# EAGLE design megamidi (EAGLE 7.3.0)
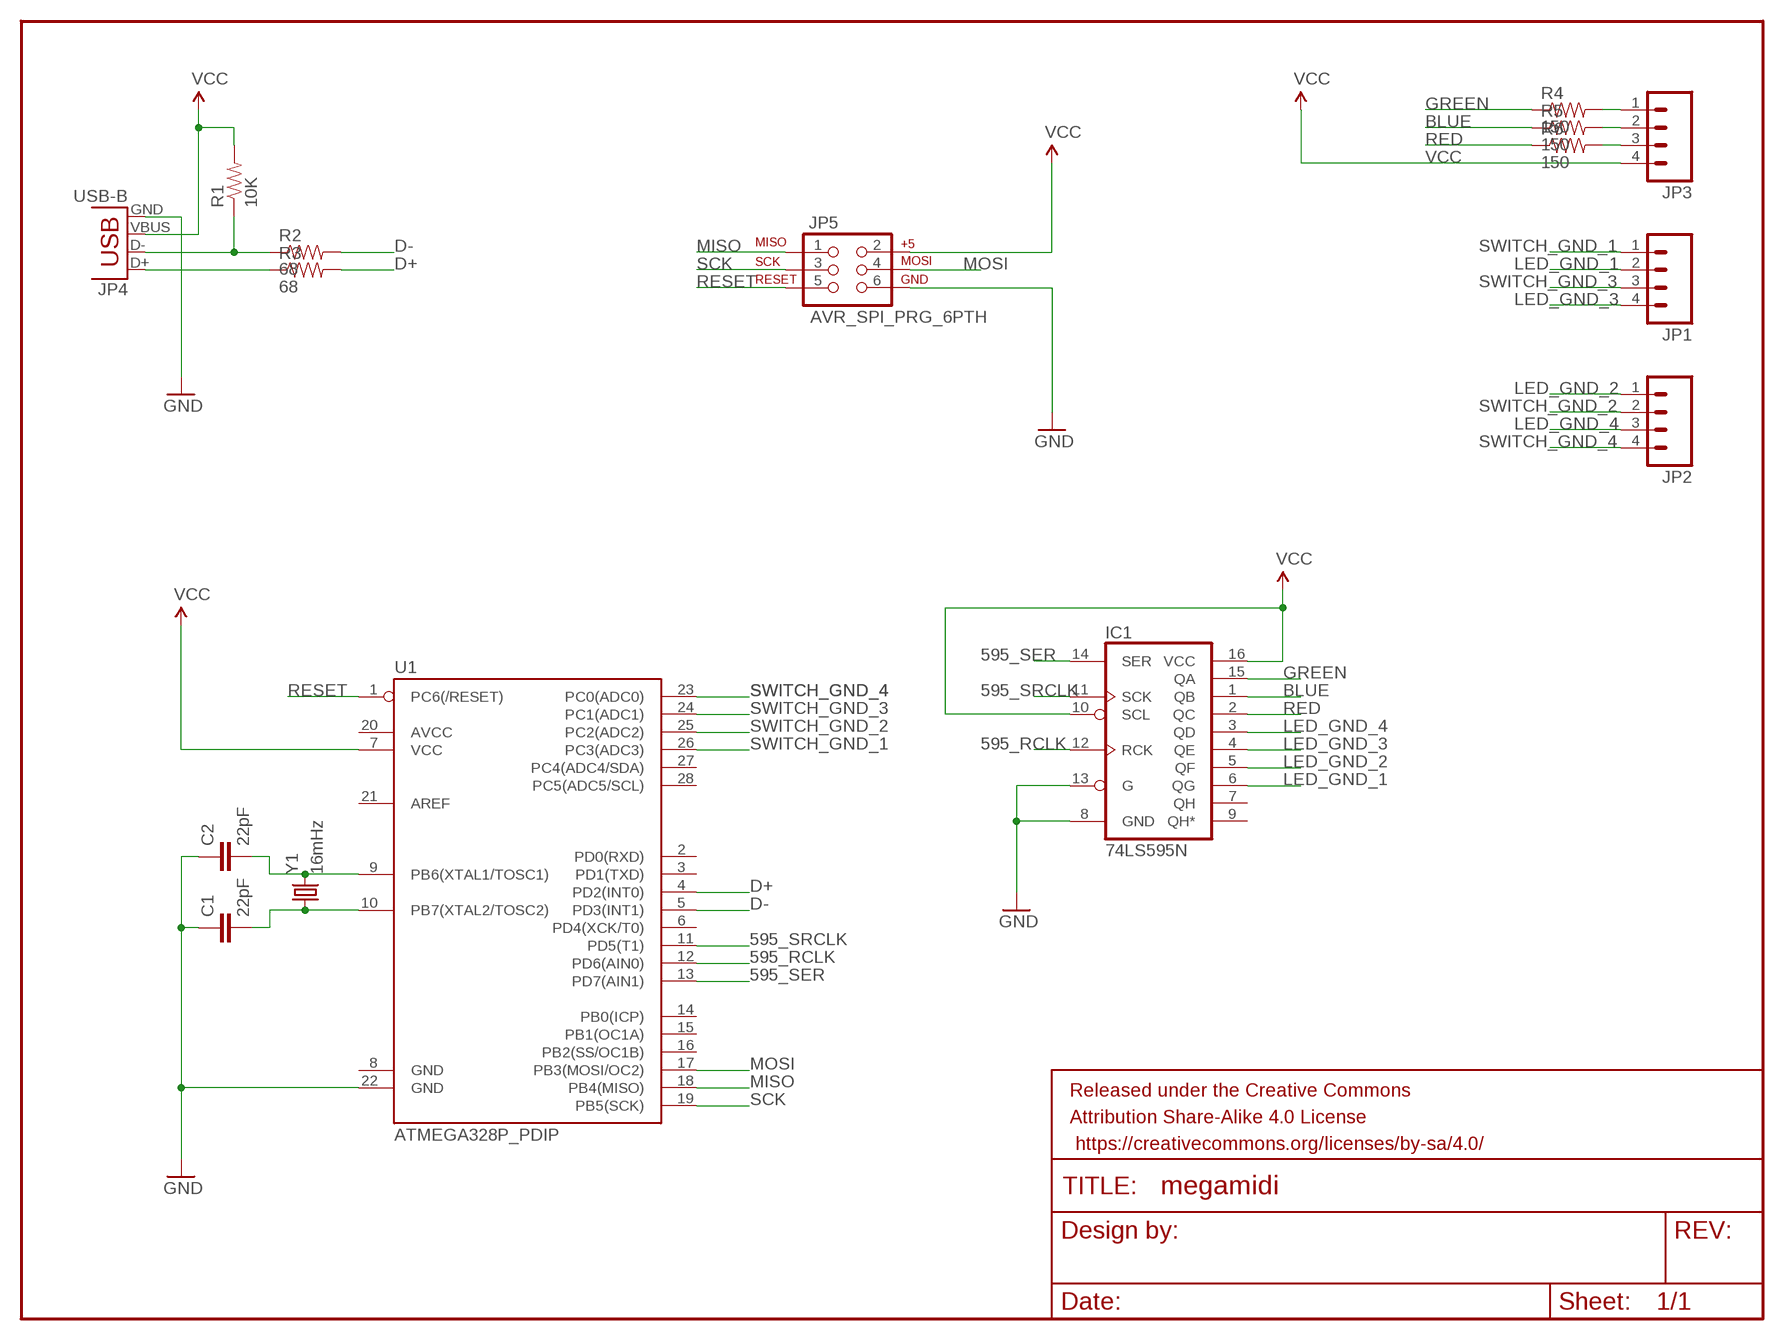
[diagram p0: schematic, sheet 1]

## Parts
C1  22pF  CAPPTH  [CAP-PTH-SMALL]
C2  22pF  CAPPTH  [CAP-PTH-SMALL]
FRAME1  FRAME-LETTER  [CREATIVE_COMMONS]
IC1  74LS595N  [DIL16]
JP1  M04PTH  [1X04]
JP2  M04PTH  [1X04]
JP3  M04PTH  [1X04]
JP4  USB-B  USBPTH  [USB-B-PTH]
JP5  AVR_SPI_PRG_6PTH  [2X3]
R1  10K  RESISTORPTH-1/4W-VERT  [AXIAL-0.1]
R2  68  RESISTORPTH-1/4W-VERT  [AXIAL-0.1]
R3  68  RESISTORPTH-1/4W-VERT  [AXIAL-0.1]
R4  150  RESISTORPTH-1/4W-VERT  [AXIAL-0.1]
R5  150  RESISTORPTH-1/4W-VERT  [AXIAL-0.1]
R6  150  RESISTORPTH-1/4W-VERT  [AXIAL-0.1]
U1  ATMEGA328P_PDIP  [DIL28-3]
Y1  16mHz  CRYSTALHC49US  [HC49US]

## Nets
595_RCLK: IC1.12(RCK) U1.12(PD6(AIN0))
595_SER: IC1.14(SER) U1.13(PD7(AIN1))
595_SRCLK: IC1.11(SCK) U1.11(PD5(T1))
BLUE: IC1.1(QB) R5.P$1
D+: R3.P$2 U1.4(PD2(INT0))
D-: R2.P$2 U1.5(PD3(INT1))
GND: C1.1 C2.1 IC1.8(GND) IC1.13(G) JP4.GND JP5.6 U1.22(GND)
GREEN: IC1.15(QA) R4.P$1
LED_GND_1: IC1.6(QG) JP1.2
LED_GND_2: IC1.5(QF) JP2.1
LED_GND_3: IC1.4(QE) JP1.4
LED_GND_4: IC1.3(QD) JP2.3
MISO: JP5.1 U1.18(PB4(MISO))
MOSI: JP5.4 U1.17(PB3(MOSI/OC2))
N$2: JP4.D- R1.P$1 R2.P$1
N$3: JP4.D+ R3.P$1
N$4: JP3.3 R6.P$2
N$5: JP3.2 R5.P$2
N$6: C2.2 U1.9(PB6(XTAL1/TOSC1)) Y1.2
N$7: C1.2 U1.10(PB7(XTAL2/TOSC2)) Y1.1
N$8: JP3.1 R4.P$2
RED: IC1.2(QC) R6.P$1
RESET: JP5.5 U1.1(PC6(/RESET))
SCK: JP5.3 U1.19(PB5(SCK))
SWITCH_GND_1: JP1.1 U1.26(PC3(ADC3))
SWITCH_GND_2: JP2.2 U1.25(PC2(ADC2))
SWITCH_GND_3: JP1.3 U1.24(PC1(ADC1))
SWITCH_GND_4: JP2.4 U1.23(PC0(ADC0))
VCC: IC1.10(SCL) IC1.16(VCC) JP3.4 JP4.VBUS JP5.2 R1.P$2 U1.7(VCC)
Unconnected: IC1.7(QH) IC1.9(QH*) U1.2(PD0(RXD)) U1.3(PD1(TXD)) U1.6(PD4(XCK/T0)) U1.8(GND) U1.14(PB0(ICP)) U1.15(PB1(OC1A)) U1.16(PB2(SS/OC1B)) U1.20(AVCC) U1.21(AREF) U1.27(PC4(ADC4/SDA)) U1.28(PC5(ADC5/SCL))

## Library data of the parts
C1 C2 = SparkFun-Capacitors:CAP: Capacitor Standard 0603 ceramic capacitor, and 0.1" leaded capacitor.
FRAME1 = SparkFun-Aesthetics:FRAME-LETTER: Schematic Frame Standard 8.5x11 US Letter frame
IC1 = SparkFun-DigitalIC:74*595: 8-bit SHIFT REGISTER, output latch
JP1-JP3 = SparkFun-Connectors:M04: Header 4 Standard 4-pin 0.1" header. Use with straight break away headers (SKU : PRT-00116), right angle break away headers (PRT-00553), swiss pins (PRT-00743), machine pins (PRT-00117), and female headers (PRT-00115). Molex polarized connector foot print use with SKU : PRT-08231 with associated crimp pins and housings. 1MM SMD Version SKU: PRT-10208
JP4 = SparkFun-Connectors:USB: USB Connectors USB-B-PTH is fully proven SKU : PRT-00139/CONN-08278 USB-miniB is fully proven SKU : PRT-00587 USB-A-PCB is untested. USB-A-H is throughly reviewed, but untested. Spark Fun Electronics SKU : PRT-00437 USB-B-SMT is throughly reviewed, but untested. Needs silkscreen touching up. USB-A-S has not been used/tested USB-MB-H has not been used/tested USB-MICROB has been used. CONN-09505; PROD_ID: CONN-08278
JP5 = SparkFun-Connectors:AVR_SPI_PRG_6: AVR ISP 6 Pin This is the reduced ISP connector for AVR programming. Common on Arduino. This footprint will take up less PCB space and can be used with a 10-pin to 6-pin adapter such as SKU: BOB-08508 **Special note about "TEST_POINT" package. The stop mask is on the top side, so if you want your programming test points to be on the bottom of your board, make sure to place this package on the bottom side of the board. This also ensure that the orientation to program from the bottom side will be correct.
R1-R6 = SparkFun-Resistors:RESISTOR: Resistor Basic schematic elements and footprints for 0603, 1206, and PTH resistors.
U1 = SparkFun-DigitalIC:ATMEGA328P_PDIP: uC used in the Arduino 32kb flash, 1k EEPROM, 2k SRAM This is the through-hole version of this chip.
Y1 = SparkFun-FreqCtrl:CRYSTAL: Various standard crystals. Proven footprints.

## Board
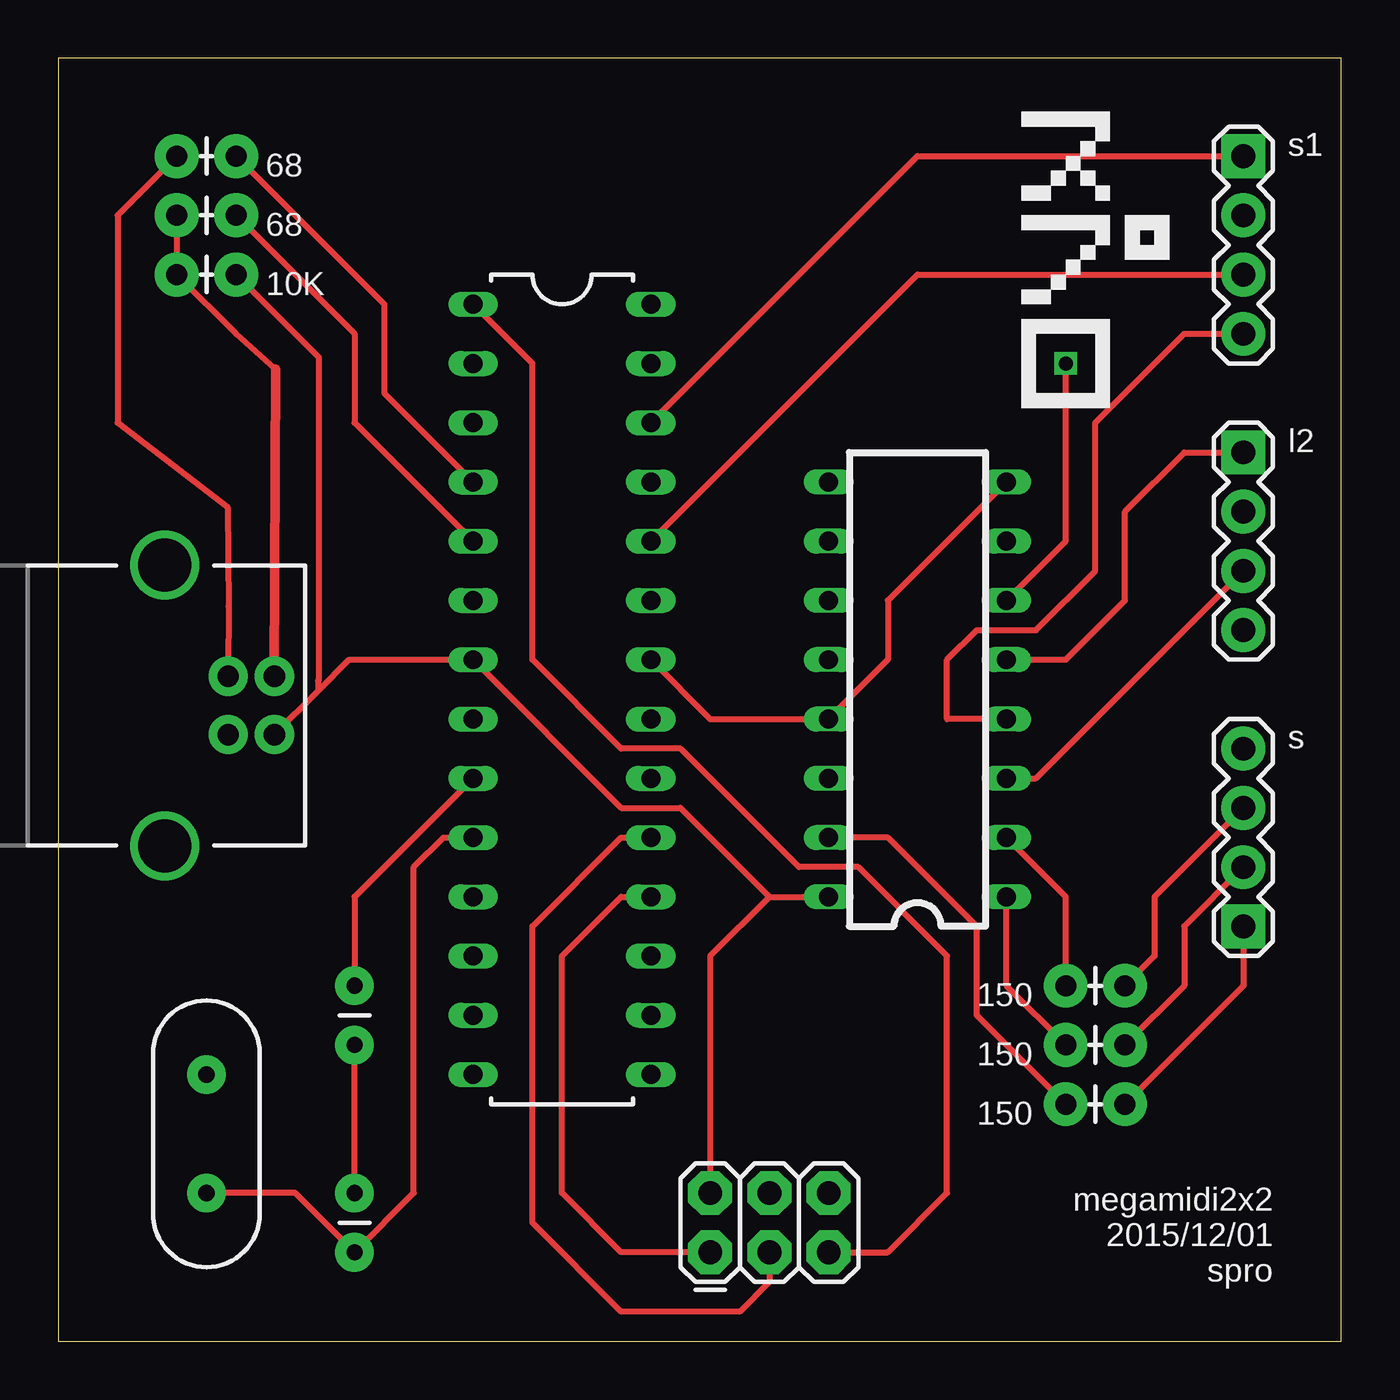
[diagram p1: board, top side]
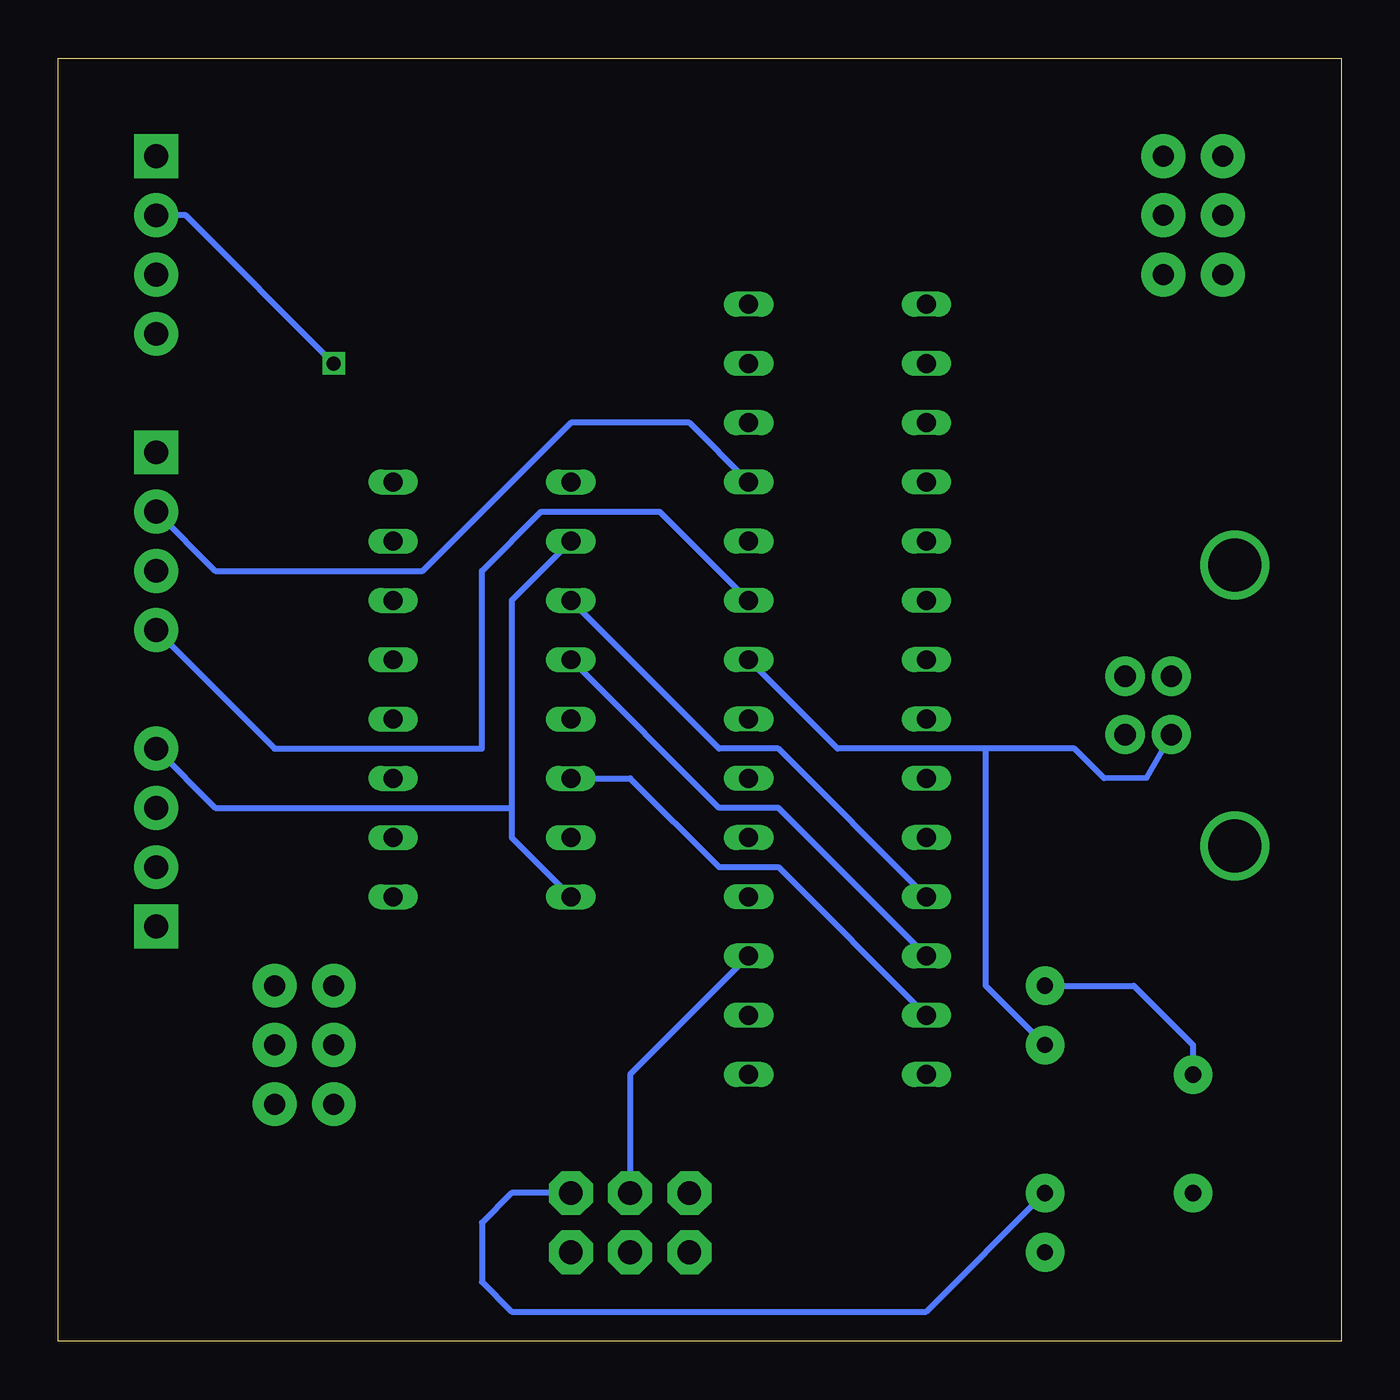
[diagram p2: board, bottom side, seen from below]

Size 54.99 x 54.99 mm. Coordinates in mm from the lower left corner, seen from the top.
Outline: 0,0 54.99,0 54.99,54.99 0,54.99 0,0
Copper layers (1*16): Top 0.0356mm / dielectric 1.5011mm / Bottom 0.0356mm
Design rules "LaenPCBOrder *": minimum track width 6mil, minimum drill 13mil, track to track 6mil, track to pad 6mil, pad to pad 6mil, via to via 6mil, smd to smd 6mil, copper to edge 15mil, drill to drill 6mil, minimum pad ring 5mil, minimum via ring 7mil, stop-mask expansion 3mil, vias tented up to drill 0mil, thermal gap 10mil

### Footprints (pad centres in the part's own frame; a part is rotated, then mirrored left to right if it is on the bottom)
CAP-PTH-SMALL = drill 0.7 pad 1.651: 1 0,0; 2 2.54,0
DIL16 = drill 0.813 long: 1 -8.89,-3.81; 2 -6.35,-3.81; 3 -3.81,-3.81; 4 -1.27,-3.81; 5 1.27,-3.81; 6 3.81,-3.81; 7 6.35,-3.81; 8 8.89,-3.81; 9 8.89,3.81; 10 6.35,3.81; 11 3.81,3.81; 12 1.27,3.81; 13 -1.27,3.81; 14 -3.81,3.81; 15 -6.35,3.81; 16 -8.89,3.81
1X04 = drill 1.016 pad 1.88 square: 1 0,0 | drill 1.016 pad 1.88: 2 2.54,0; 3 5.08,0; 4 7.62,0
USB-B-PTH = drill 0.914 pad 1.676: D+ 0,1.25; D- 1.981,1.25; GND 0,-1.25; VBUS 1.981,-1.25 | drill 2.286: S1 -2.718,-6.02; S2 -2.718,6.02
2X3 = drill 1.016 pad 1.88 octagon: 1 0,0; 2 0,2.54; 3 2.54,0; 4 2.54,2.54; 5 5.08,0; 6 5.08,2.54
AXIAL-0.1 = drill 0.9 pad 1.88: P$1 0,0; P$2 2.54,0
DIL28-3 = drill 0.813 long: 1 -16.51,-3.81; 2 -13.97,-3.81; 3 -11.43,-3.81; 4 -8.89,-3.81; 5 -6.35,-3.81; 6 -3.81,-3.81; 7 -1.27,-3.81; 8 1.27,-3.81; 9 3.81,-3.81; 10 6.35,-3.81; 11 8.89,-3.81; 12 11.43,-3.81; 13 13.97,-3.81; 14 16.51,-3.81; 15 16.51,3.81; 16 13.97,3.81; 17 11.43,3.81; 18 8.89,3.81; 19 6.35,3.81; 20 3.81,3.81; 21 1.27,3.81; 22 -1.27,3.81; 23 -3.81,3.81; 24 -6.35,3.81; 25 -8.89,3.81; 26 -11.43,3.81; 27 -13.97,3.81; 28 -16.51,3.81
HC49US = drill 0.7 pad 1.651: 1 -2.54,0; 2 2.54,0

### Placement (x,y rotation side)
C1  12.7,6.35 270 top
C2  12.7,12.7 90 top
FRAME1  -5.08,62.23 0 top  (outside the outline)
IC1  36.83,27.94 90 top
JP1  50.8,50.8 270 top
JP2  50.8,38.1 270 top
JP3  50.8,17.78 90 top
JP4  7.28,27.25 0 top
JP5  27.94,3.81 0 top
R1  5.08,45.72 0 top
R2  5.08,48.26 0 top
R3  5.08,50.8 0 top
R4  43.18,10.16 0 top
R5  43.18,12.7 0 top
R6  43.18,15.24 0 top
U1  21.59,27.94 270 top
Y1  6.35,8.89 90 top

### Tracks (layer width: path | path; a pad name or v marks a point on that pad's centre or on a via)
595_RCLK
  Bottom 0.254: U1.12 24.13,22.86 26.67,22.86 IC1.12
595_SER
  Bottom 0.254: U1.13 24.13,20.32 26.67,20.32 30.48,24.13 IC1.14
595_SRCLK
  Bottom 0.254: U1.11 24.13,25.4 26.67,25.4 IC1.11
BLUE
  Top 0.254: R5.P$1 40.64,15.24 IC1.1
D+
  Top 0.254: R3.P$2 13.97,44.45 13.97,40.64 U1.4
D-
  Top 0.254: R2.P$2 12.7,43.18 12.7,39.37 U1.5
GND
  Top 0.254: C1.1 C2.1 | U1.22 27.94,26.67 IC1.13 35.56,29.21 35.56,31.75 IC1.8
  Bottom 0.254: JP4.GND 8.35,24.15 10.16,24.13 11.43,25.4 15.24,25.4 | 15.24,25.4 21.59,25.4 U1.22 | JP5.6 35.56,6.35 36.83,5.08 36.83,2.54 35.56,1.27 17.78,1.27 C1.1 | C2.1 15.24,15.24 15.24,25.4
GREEN
  Top 0.254: R4.P$1 39.37,13.97 39.37,17.78 35.56,21.59 IC1.15
LED_GND_1  (via drill 0.6)
  Top 0.254: IC1.6 43.18,34.29 v43.18,41.91
  Bottom 0.254: v43.18,41.91 49.53,48.26 JP1.2
LED_GND_2
  Top 0.254: IC1.5 43.18,29.21 45.72,31.75 45.72,35.56 48.26,38.1 JP2.1
LED_GND_3
  Top 0.254: IC1.4 38.1,26.67 38.1,29.21 39.37,30.48 41.91,30.48 44.45,33.02 44.45,39.37 48.26,43.18 JP1.4
LED_GND_4
  Top 0.254: IC1.3 41.91,24.13 JP2.3
MISO
  Top 0.254: U1.18 24.13,19.05 21.59,16.51 21.59,6.35 24.13,3.81 JP5.1
MOSI
  Bottom 0.254: U1.17 30.48,11.43 JP5.4
N$2
  Top 0.254: 9.32,41.67 7.62,43.18 R1.P$1 R2.P$1
  Top 0.406: JP4.D- 9.32,41.67
N$3
  Top 0.254: R3.P$1 2.54,48.26 2.54,39.37 7.25,35.76 7.3,31.5 7.28,28.72 JP4.D+
N$4
  Top 0.254: JP3.3 46.99,19.05 46.99,16.51 R6.P$2
N$5
  Top 0.254: JP3.2 48.26,17.78 48.26,15.24 R5.P$2
N$6
  Top 0.254: U1.9 12.7,19.05 C2.2
  Bottom 0.254: C2.2 8.89,15.24 6.35,12.7 Y1.2
N$7
  Top 0.254: Y1.1 10.16,6.35 C1.2 15.24,6.35 15.24,20.32 16.51,21.59 U1.10
N$8
  Top 0.254: JP3.1 50.8,15.24 R4.P$2
RED
  Top 0.254: R6.P$1 43.18,19.05 IC1.2
RESET
  Top 0.254: JP5.5 35.56,3.81 38.1,6.35 38.1,16.51 34.29,20.32 31.75,20.32 26.67,25.4 24.13,25.4 20.32,29.21 20.32,41.91 U1.1
SCK
  Top 0.254: JP5.3 30.48,2.54 29.21,1.27 24.13,1.27 20.32,5.08 20.32,17.78 24.13,21.59 U1.19
SWITCH_GND_1
  Top 0.254: U1.26 36.83,50.8 JP1.1
SWITCH_GND_2
  Bottom 0.254: JP2.2 48.26,33.02 39.37,33.02 33.02,39.37 27.94,39.37 U1.25
SWITCH_GND_3
  Top 0.254: U1.24 36.83,45.72 JP1.3
SWITCH_GND_4
  Bottom 0.254: U1.23 29.21,35.56 34.29,35.56 36.83,33.02 36.83,25.4 45.72,25.4 JP2.4
VCC
  Top 0.254: R1.P$2 11.16,42.18 11.16,28.34 11.13,28.31 11.13,27.87 | 30.48,19.05 26.67,22.86 24.13,22.86 U1.7 12.47,29.21 11.13,27.87 | 30.48,19.05 IC1.16 | 30.48,19.05 27.94,16.51 JP5.2 | JP4.VBUS 11.13,27.87
  Bottom 0.254: IC1.10 35.56,31.75 35.56,22.86 | 35.56,22.86 35.56,21.59 IC1.16 | JP3.4 48.26,22.86 35.56,22.86

### Text on the board
tNames: s1 | l2 | s | megamidi2x2 / 2015/12/01 / spro